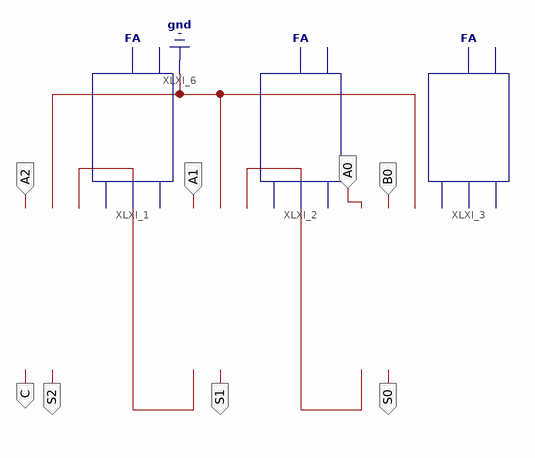
[diagram p0: schematic sheet 1]
// Xilinx ISE schematic Adder_3_bit.sch (spartan3e) as structural Verilog: 3 symbols, 8 ports
module Adder_3_bit (
  input  A2,
  input  A1,
  input  A0,
  input  B0,
  output C,
  output S2,
  output S1,
  output S0
);

  wire XLXN_1, XLXN_2;

  FA XLXI_1 (.A(A2), .B(1'b0), .C_in(XLXN_1), .C_out(C), .S(S2));
  FA XLXI_2 (.A(A1), .B(1'b0), .C_in(XLXN_2), .C_out(XLXN_1), .S(S1));
  FA XLXI_3 (.A(A0), .B(B0), .C_in(1'b0), .C_out(XLXN_2), .S(S0));
endmodule
